# Altium schematic sheet Communications_Power.SchDoc: Communications Power
size A4; DrawnBy: Igor Bubanja, Tim Oorschot; Address1: ECE Department; Address2: University of Canterbury; Address3: Christchurch 8041; Address4: New Zealand; Revision: 3; SheetNumber: 2; SheetTotal: 3; PageSetup: Record=PageOptions|CenterHorizontal=True|CenterVertical=True|PrintScale=0.97|XCorrection=1.00|YCorrection=1.00|PrintKind=0|BorderSize=5000000|LeftOffset=0|BottomOffset=0|Orientation=2|PaperLength=1000|PaperWidth=1000|Scale=100|PaperSource=7|PrintQuality=-3|MediaType=1|DitherType=10|PrintScaleMode=1|PaperKind=A4 (210 x 297 mm)|PaperIndex=9
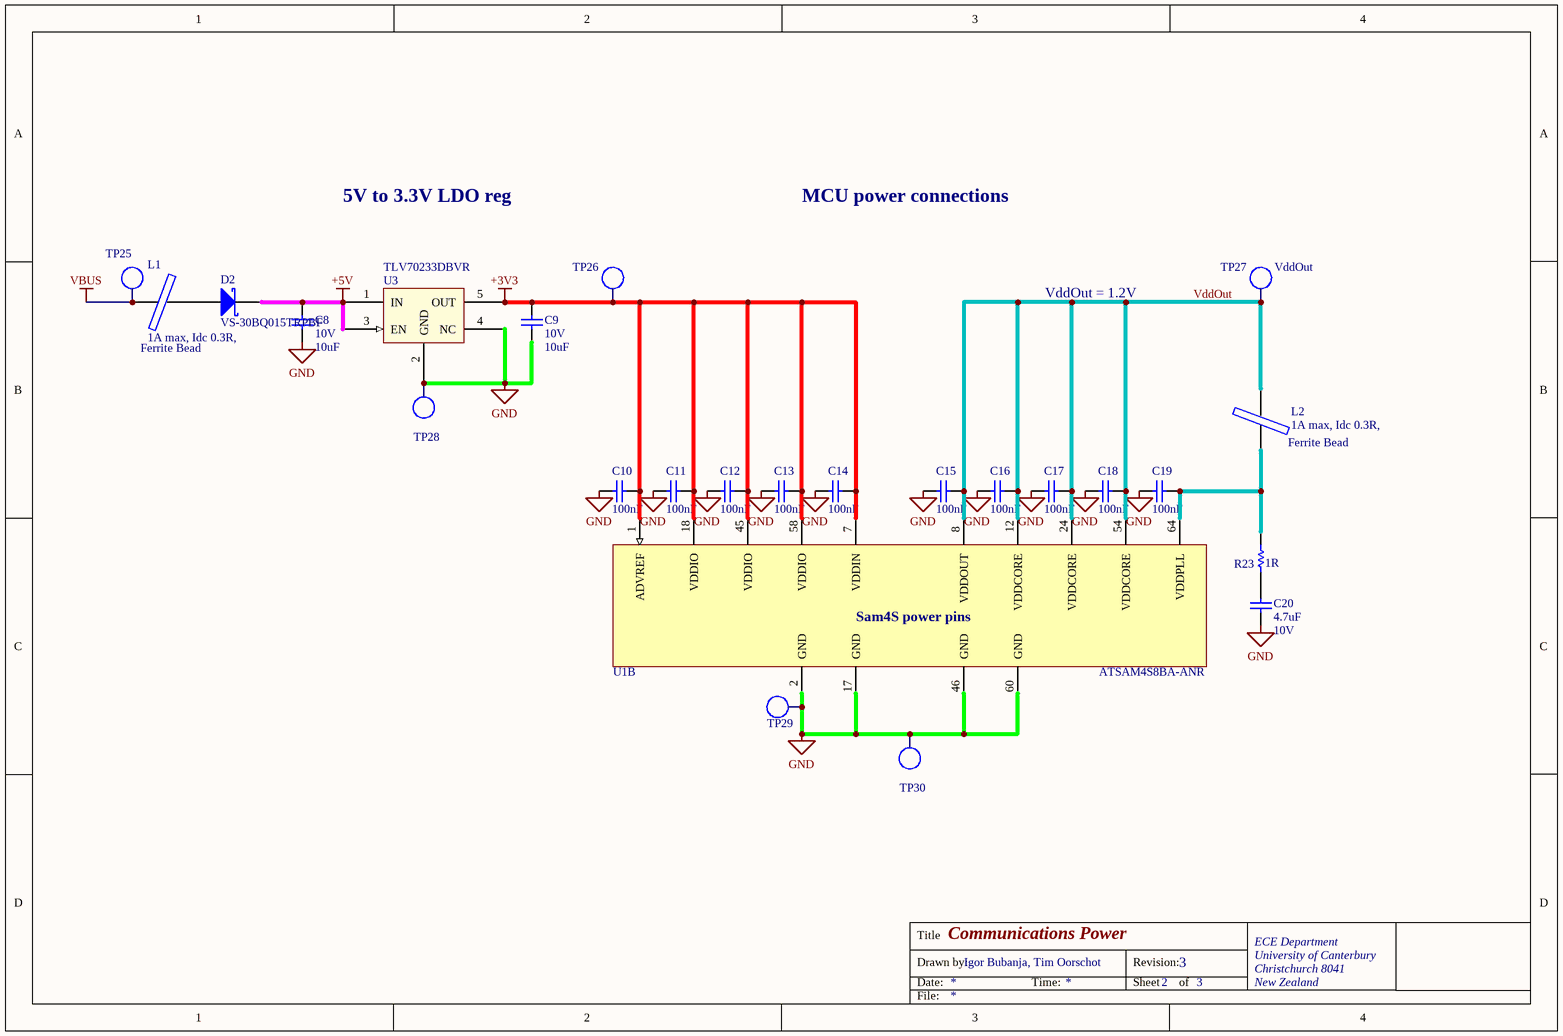
[diagram p0: Communications_Power.SchDoc]

## Parts
C8  Voltage - Rated: 10V  [CAPC1608L]  (hidden comment: 10uF)
C9  Voltage - Rated: 10V  [CAPC1608L]  (hidden comment: 10uF)
C10  100nF  [CAPC1608L]
C11  100nF  [CAPC1608L]
C12  100nF  [CAPC1608L]
C13  100nF  [CAPC1608L]
C14  100nF  [CAPC1608L]
C15  100nF  [CAPC1608L]
C16  100nF  [CAPC1608L]
C17  100nF  [CAPC1608L]
C18  100nF  [CAPC1608L]
C19  100nF  [CAPC1608L]
C20  Max Voltage: 10V  [CAPC1608N]  (hidden comment: 4.7uF)
D2  VS-30BQ015TRPBF  [SMC]
L1  Ferrite Bead  value 1A max, Idc 0.3R,  [INDC3216L]
L2  Ferrite Bead  value 1A max, Idc 0.3R,  [INDC3216L]
R23  1R  [RESC3216L]
TP25  V_Bus  [TP_0805]  (value not drawn)
TP26  3V3  [TP_0805]  (value not drawn)
TP27  VddOut  [TP_0805]
TP28  Gnd  [TP_0805]  (value not drawn)
TP29  Gnd  [TP_0805]  (value not drawn)
TP30  Gnd  [TP_0805]  (value not drawn)
U1  ATSAM4S8BA-ANR  [LQFP64_L]  (part B of 2)
U3  TLV70233DBVR  [SOT95P280X145-5N]

## Nets
+3V3: C9.1 C10.2 C11.2 C12.2 C13.2 C14.2 TP26.1(TP) U1.1(ADVREF) U1.7(VDDIN) U1.18(VDDIO) U1.45(VDDIO) U1.58(VDDIO) U3.5(OUT)
+5V: C8.1 D2.2(K) U3.1(IN) U3.3(EN)
GND: C8.2 C9.2 C10.1 C11.1 C12.1 C13.1 C14.1 C15.1 C16.1 C17.1 C18.1 C19.1 C20.1 TP28.1(TP) TP29.1(TP) TP30.1(TP) U1.2(GND) U1.17(GND) U1.46(GND) U1.60(GND) U3.2(GND) U3.4(NC)
VBUS: L1.1 TP25.1(TP)
VddOut: C15.2 C16.2 C17.2 C18.2 L2.2 TP27.1(TP) U1.8(VDDOUT) U1.12(VDDCORE) U1.24(VDDCORE) U1.54(VDDCORE)
NetC19_2: C19.2 L2.1 R23.2 U1.64(VDDPLL)
NetC20_2: C20.2 R23.1
NetD2_1: D2.1(A) L1.2

## Notes on the sheet
- 5V to 3.3V LDO reg
- MCU power connections
- VddOut = 1.2V
- (near U1) Sam4S power pins
- Title
- Drawn by:
- Date:
- Time:
- Revision:
- Sheet
- of
- File:

## Library data of the parts
C8 C9 = CC_10uF_0603: CAP CER 10UF X5R +-20% 10V 0603; Supplier: ECE Dept; Storage Location: PCB Assembly WS; Value: 10uF
C10-C19 = CC_100nF_0603: CAP CER 100nF X7R +-10% 50V 0603; PackageReference: 0603; Code_IPC: 1608 [0603]; Verify: *; Supplier: ECE Dept; Storage Location: PCB Assembly WS; Value: 100nF
C20 = CC_4.7uF_0603: CAP CER 4.7uF X5R +-20%  10V 0603; Note: Footprint corresponds to dimensions for bulk cassette packaging. This case size has tightened tolerances.; PackageReference: 0805; Code_IPC: 2012[0805]; Verify: *; Supplier: ECE Dept; Storage Location: PCB Assembly WS; Value: 4.7uF
D2 = DS_VS-30BQD015TRPBF: DIODE SCHOTTKY 15V 3A SMC; Manufacturer: Vishay Semiconductor Diodes Division; Current - Reverse Leakage @ Vr: 4mA @ 15V; Voltage - Forward (Vf) (Max) @ If: 350mV @ 3A; Current - Average Rectified (Io): 3A; Package / Case: DO-214AB, SMC; Pricing: 1=1.59, 10=1.417, 25=1.2504, 100=1.1253, 250=0.97944, 500=0.87526, 1000=0.6877 (NZD); Supplier 1: Digi-Key; Supplier Part Number 1: 30BQ015PBFCT-ND; Supplier 2: Farnell; Supplier Part Number 2: 9101250; Supplier 3: Mouser; Supplier Part Number 3: N/A; Storage Location: PCB Assembly WS; Supplier: ECE Dept; Manufacturer Part Number: VS-30BQ015TRPBF
L1 L2 = IN_Ferrite-Bead: Ferrite Bead, Rdc 0.3R, Z100MHZ 600R, Imax 1A, SMD 1206; Manufacturer: FAIR-RITE; Manufacturer PN: 2512066017Y1; DC Current Rating: 1; DC Resistance Max: 0.08; Ferrite Case Style: 1206 ^3216 Metric]; Frequency Range: 50MHz to 1; Impedance: 600; Impedance Tolerance: ± 25%; Supplier: ECE Dept; Storage Location: PCB Assembly WS; Ferrite Mounting: SMD; Supplier 1: Farnell; Supplier Part Number 1: 1612060; Manufacturer Part Number: 2512066017Y1
R23 = RT_1R: RES 1R OHM 1/4W 5% 1206 SMD; Storage Location: PCB Assembly WS; Supplier: ECE Dept; Value: 1R
TP25-TP30 = TP_0805: Test Point 2.0X0.9X1.2mm SMD; Manufacturer: TE Connectivity AMP Connectors; Manufacturer Part Number: 1625854-2; Supplier 1: Digi-Key; Mounting Type: Surface Mount; Terminal: 0.079" x 0.049" x 0.057" (2.00mm x 1.25mm x 1.45mm); Type: PC Test Point; Supplier Part Number 1: A106144CT-ND
U1 = SE_ATSAM4S16BA-MU: IC MCU 32BIT 512KB FLASH 64LQFP; Manufacturer: Atmel; Connectivity: I²C, IrDA, Memory Card, SPI, SSC, UART/USART, USB; Core Processor: ARM® Cortex®-M4; Core Size: 32-Bit; Data Converters: A/D 11x12b, D/A 2x12b; Number of I/O: 47; Peripherals: Brown-out Detect/Reset, DMA, POR, PWM, WDT; Program Memory Size: 512KB (512K x 8); RAM Size: 128K x 8; Speed: 120MHz; Voltage - Supply (Vcc/Vdd): 1.62 V ~ 3.6 V; PackageVersion: revJ, Jul-2007; PackageReference: 64PS; PackageDescription: 64-Pin Quad Flat No-Lead (QFN) Sawn, 9 x 9 x 1.0 mm Body, 0.5 mm Pitch, Exposed Pad; Code_JEDEC: MO-220VMMD-3; ComponentLink1Description: Manufacturer URL; ComponentLink1URL: http://www.atmel.com/; ComponentLink2Description: SAM4S Series Datasheet; ComponentLink2URL: http://www.atmel.com/dyn/resources/prod_documents/11100.pdf; ComponentLink3Description: SAM4S Series Summary; ComponentLink3URL: http://www.atmel.com/dyn/resources/prod_documents/11100S.pdf; Supplier 1: Digi-Key; Package / Case: 64-LQFP; Packaging: Cut Tape (CT); Program Memory Type: FLASH; Supplier Part Number 1: ATSAM4S8BA-ANRCT-ND; Manufacturer Part Number: ATSAM4S8BA-ANR
U3 = SV_TLV70233DBVR: IC REG LDO 3.3V 0.3A SOT23-5; Manufacturer: Texas Instruments; Current - Output: 300mA; Supplier 1: Digi-Key; Operating Temperature: -40°C ~ 125°C; Package / Case: SC-74A, SOT-753; Pricing: 1=0.77, 10=0.647, 25=0.5672, 100=0.4853, 250=0.421, 500=0.35658, 750=0.30789, 1000=0.2749 (NZD); Supplier Part Number 1: 296-32415-1-ND; Manufacturer Part Number: TLV70233DBVR